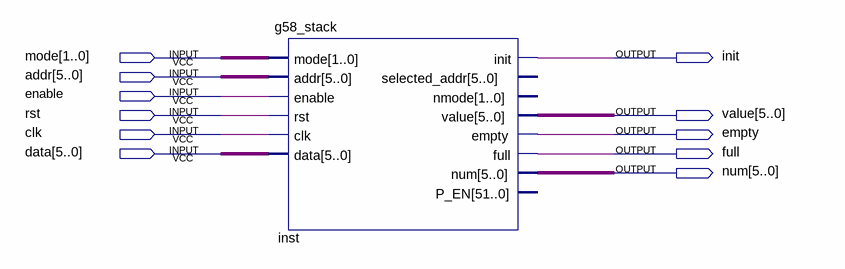
[diagram p0: schematic sheet]
// Quartus schematic g58_stack_test.bdf as structural Verilog: 1 symbols, 11 pins
module g58_stack_test (
  input  [1:0] mode,
  input  [5:0] addr,
  input  enable,
  input  rst,
  input  clk,
  input  [5:0] data,
  output init,
  output [5:0] value,
  output empty,
  output full,
  output [5:0] num
);

  g58_stack inst (
    .mode(mode), .addr(addr), .enable(enable), .rst(rst), .clk(clk), .data(data), .init(init), .value(value),
    .empty(empty), .full(full), .num(num));  // open: selected_addr, nmode, P_EN
endmodule
